# EAGLE design Transmitter_board (EAGLE 8.6.3)
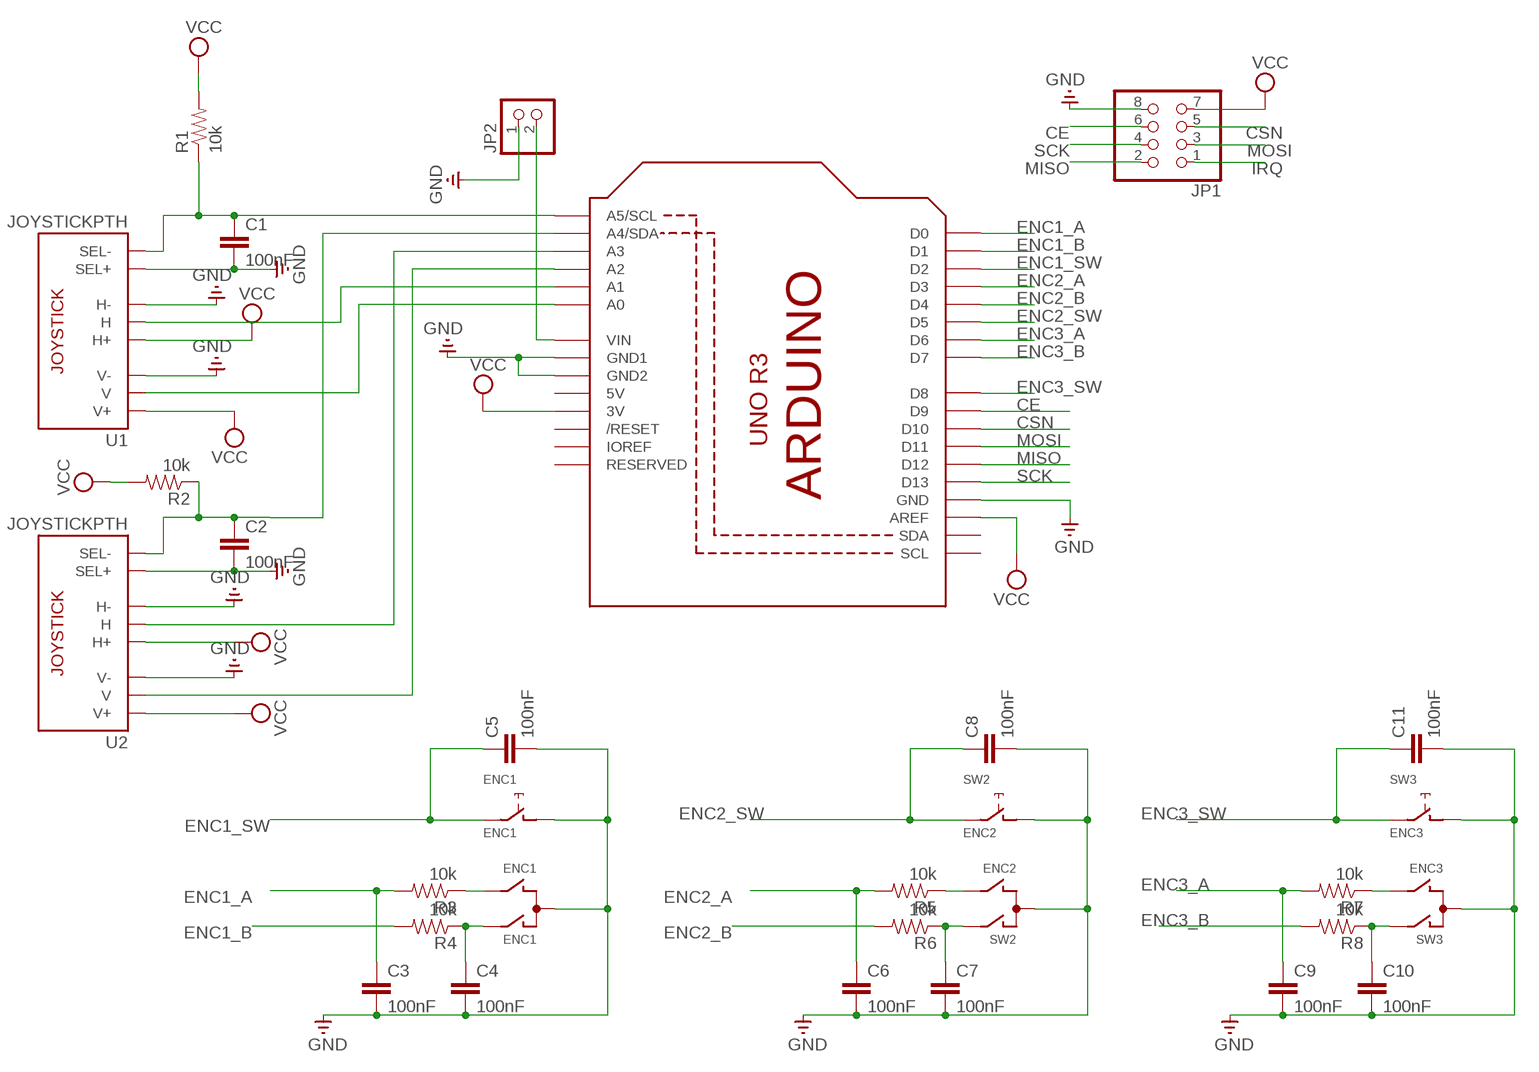
[diagram p0: schematic, sheet 1]

## Parts
C1  100nF  CAP0603-CAP  [0603-CAP]
C2  100nF  CAP0603-CAP  [0603-CAP]
C3  100nF  CAP0603-CAP  [0603-CAP]
C4  100nF  CAP0603-CAP  [0603-CAP]
C5  100nF  CAP0603-CAP  [0603-CAP]
C6  100nF  CAP0603-CAP  [0603-CAP]
C7  100nF  CAP0603-CAP  [0603-CAP]
C8  100nF  CAP0603-CAP  [0603-CAP]
C9  100nF  CAP0603-CAP  [0603-CAP]
C10  100nF  CAP0603-CAP  [0603-CAP]
C11  100nF  CAP0603-CAP  [0603-CAP]
ENC1  ENC1  EC12E_SW  [ALPS_EC12E_SW]
JP1  PINHD-2X4  [2X04]
JP2  PINHD-1X2  [1X02]
R1  10k  RESISTOR0603-RES  [0603-RES]
R2  10k  RESISTOR0603-RES  [0603-RES]
R3  10k  RESISTOR0603-RES  [0603-RES]
R4  10k  RESISTOR0603-RES  [0603-RES]
R5  10k  RESISTOR0603-RES  [0603-RES]
R6  10k  RESISTOR0603-RES  [0603-RES]
R7  10k  RESISTOR0603-RES  [0603-RES]
R8  10k  RESISTOR0603-RES  [0603-RES]
SW2  ENC2  EC12E_SW  [ALPS_EC12E_SW]
SW3  ENC3  EC12E_SW  [ALPS_EC12E_SW]
U1  JOYSTICKPTH  [JOYSTICK]
U2  JOYSTICKPTH  [JOYSTICK]
U3  STM32F746NG  ARDUINOR3-BPLACE  [ARDUINOR3-BPLACE]

## Nets
CE: JP1.6 U3.D9
CSN: JP1.5 U3.D10
ENC1_A: C3.1 R3.2 U3.D0
ENC1_B: R4.2 U3.D1
ENC1_SW: C5.1 ENC1.E U3.D2
ENC2_A: C6.1 R5.2 U3.D3
ENC2_B: R6.2 U3.D4
ENC2_SW: C8.1 SW2.E U3.D5
ENC3_A: C9.1 R7.2 U3.D6
ENC3_B: R8.2 U3.D7
ENC3_SW: C11.1 SW3.E U3.D8
GND: C1.2 C2.2 C3.2 C4.2 C5.2 C6.2 C7.2 C8.2 C9.2 C10.2 C11.2 ENC1.C ENC1.D JP1.8 JP2.1 SW2.C SW2.D SW3.C SW3.D U1.B1A(SEL+) U1.H3(H-) U1.V3(V-) U2.B1A(SEL+) U2.H3(H-) U2.V3(V-) U3.GND U3.GND1 U3.GND2
IRQ: JP1.1
MISO: JP1.2 U3.D12
MOSI: JP1.3 U3.D11
N$1: U2.V2(V) U3.A2
N$2: C2.1 R2.1 U2.B2A(SEL-) U3.A4(A4/SDA)
N$3: JP2.2 U3.VIN
N$4: C1.1 R1.1 U1.B2A(SEL-) U3.A5(A5/SCL)
N$5: C4.1 ENC1.A R4.1
N$6: C7.1 R6.1 SW2.A
N$7: ENC1.B R3.1
N$8: R5.1 SW2.B
N$9: C10.1 R8.1 SW3.A
N$10: R7.1 SW3.B
N$11: U1.H2(H) U3.A1
N$12: U1.V2(V) U3.A0
N$13: U2.H2(H) U3.A3
SCK: JP1.4 U3.D13
VCC: JP1.7 R1.2 R2.2 U1.H1(H+) U1.V1(V+) U2.H1(H+) U2.V1(V+) U3.3V U3.AREF
Unconnected: ENC1.GND1(G) ENC1.GND2(G) SW2.GND1(G) SW2.GND2(G) SW3.GND1(G) SW3.GND2(G) U3.IOREF U3.RESERVED U3.RESET(/RESET) U3.SCL U3.SDA

## Power pins joined to a net without a drawn wire
5V: U3.5V

## Library data of the parts
C1-C11 = PatternAgents-ProtoPads:CAP: Capacitor Standard 0603 ceramic capacitor, and 0.1" leaded capacitor.
ENC1 SW2 SW3 = switch-alps:EC12E_SW: ALPS rotary Encoder EC12E series with switch; MPN: EC12E2424407; OC_FARNELL: 1520813; OC_NEWARK: 74M1068
JP1 = adafruit:PINHD-2X4: PIN HEADER
JP2 = pinhead:PINHD-1X2: PIN HEADER
R1-R8 = PatternAgents-ProtoPads:RESISTOR: Resistor Basic schematic elements and footprints for 0603, 1206, and PTH resistors.
U1 U2 = adafruit:JOYSTICK: Thumb Joystick Joystick commonly found in PS2 controllers. Two pots and a select switch. Adapted from Sparkfun Library (but for more common 6mm switch sticks)
U3 = adafruit:ARDUINOR3: This is a new object for the new Arduino R3 - with extra pins that you may want to use (such as IOref, and duplicated A4/A5

## Board
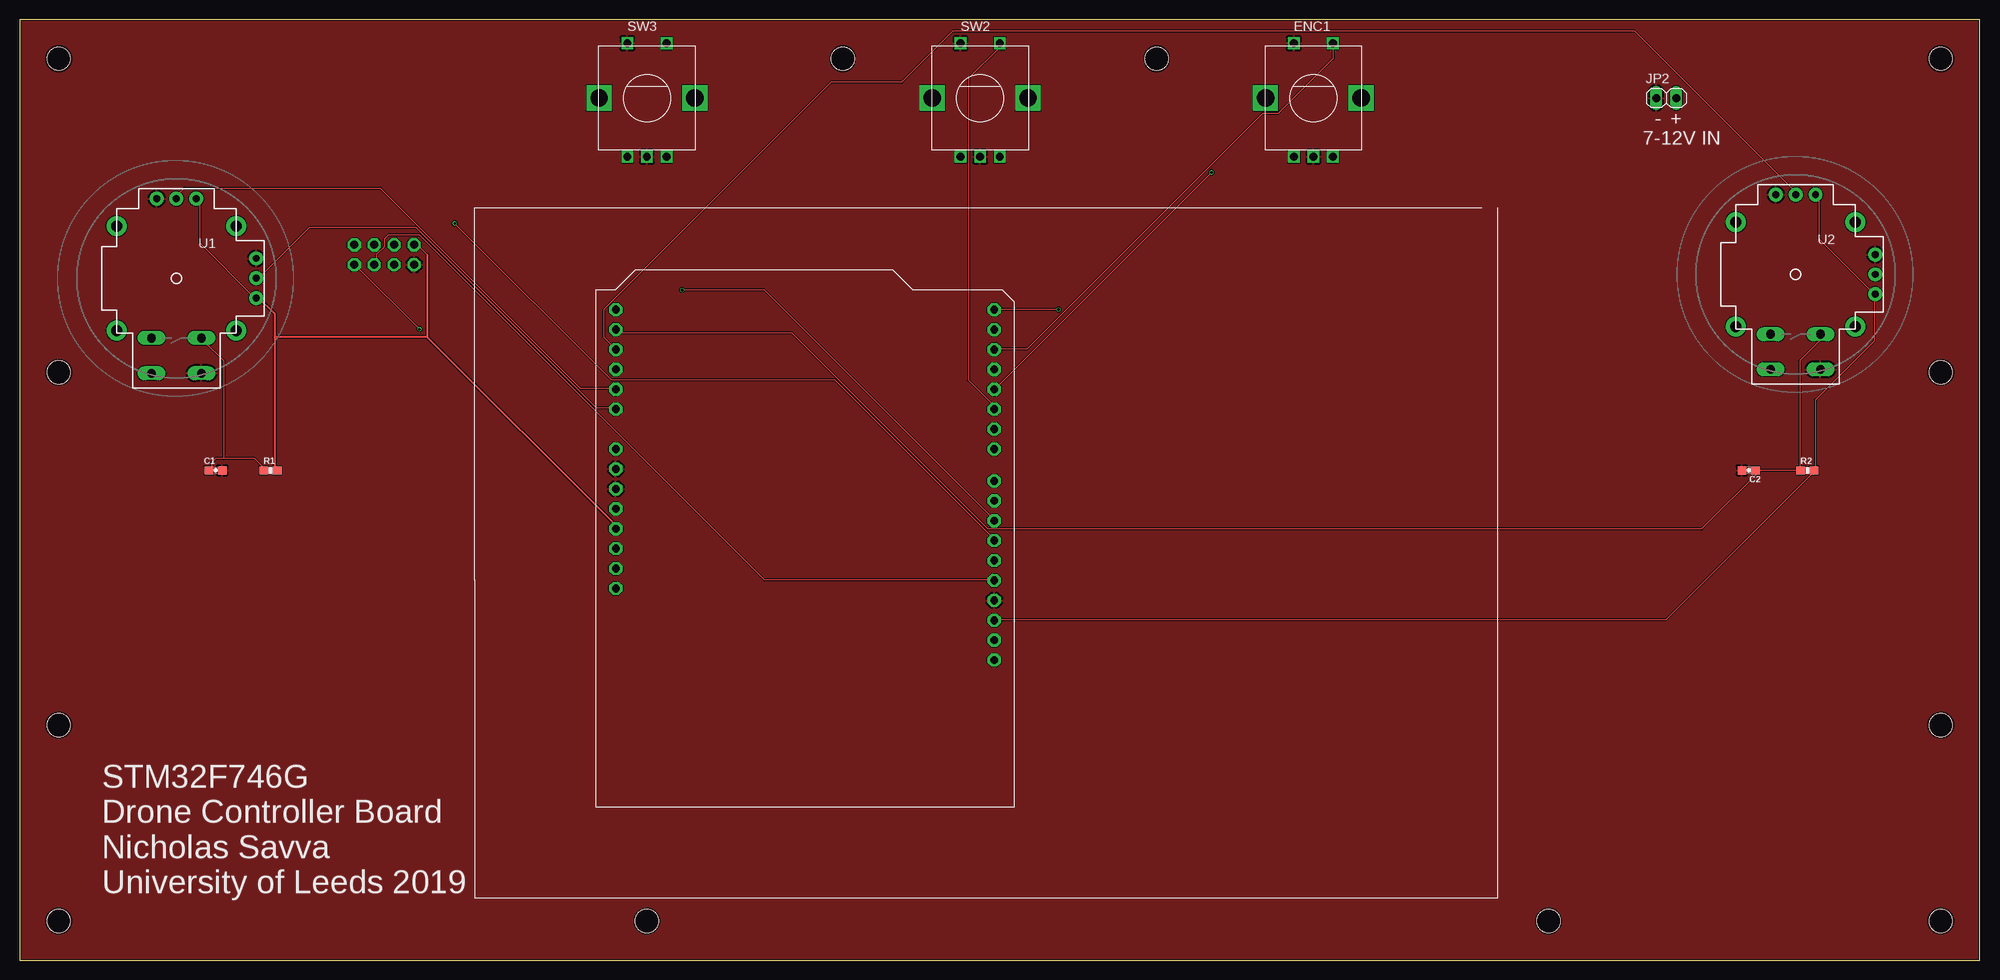
[diagram p1: board, top side]
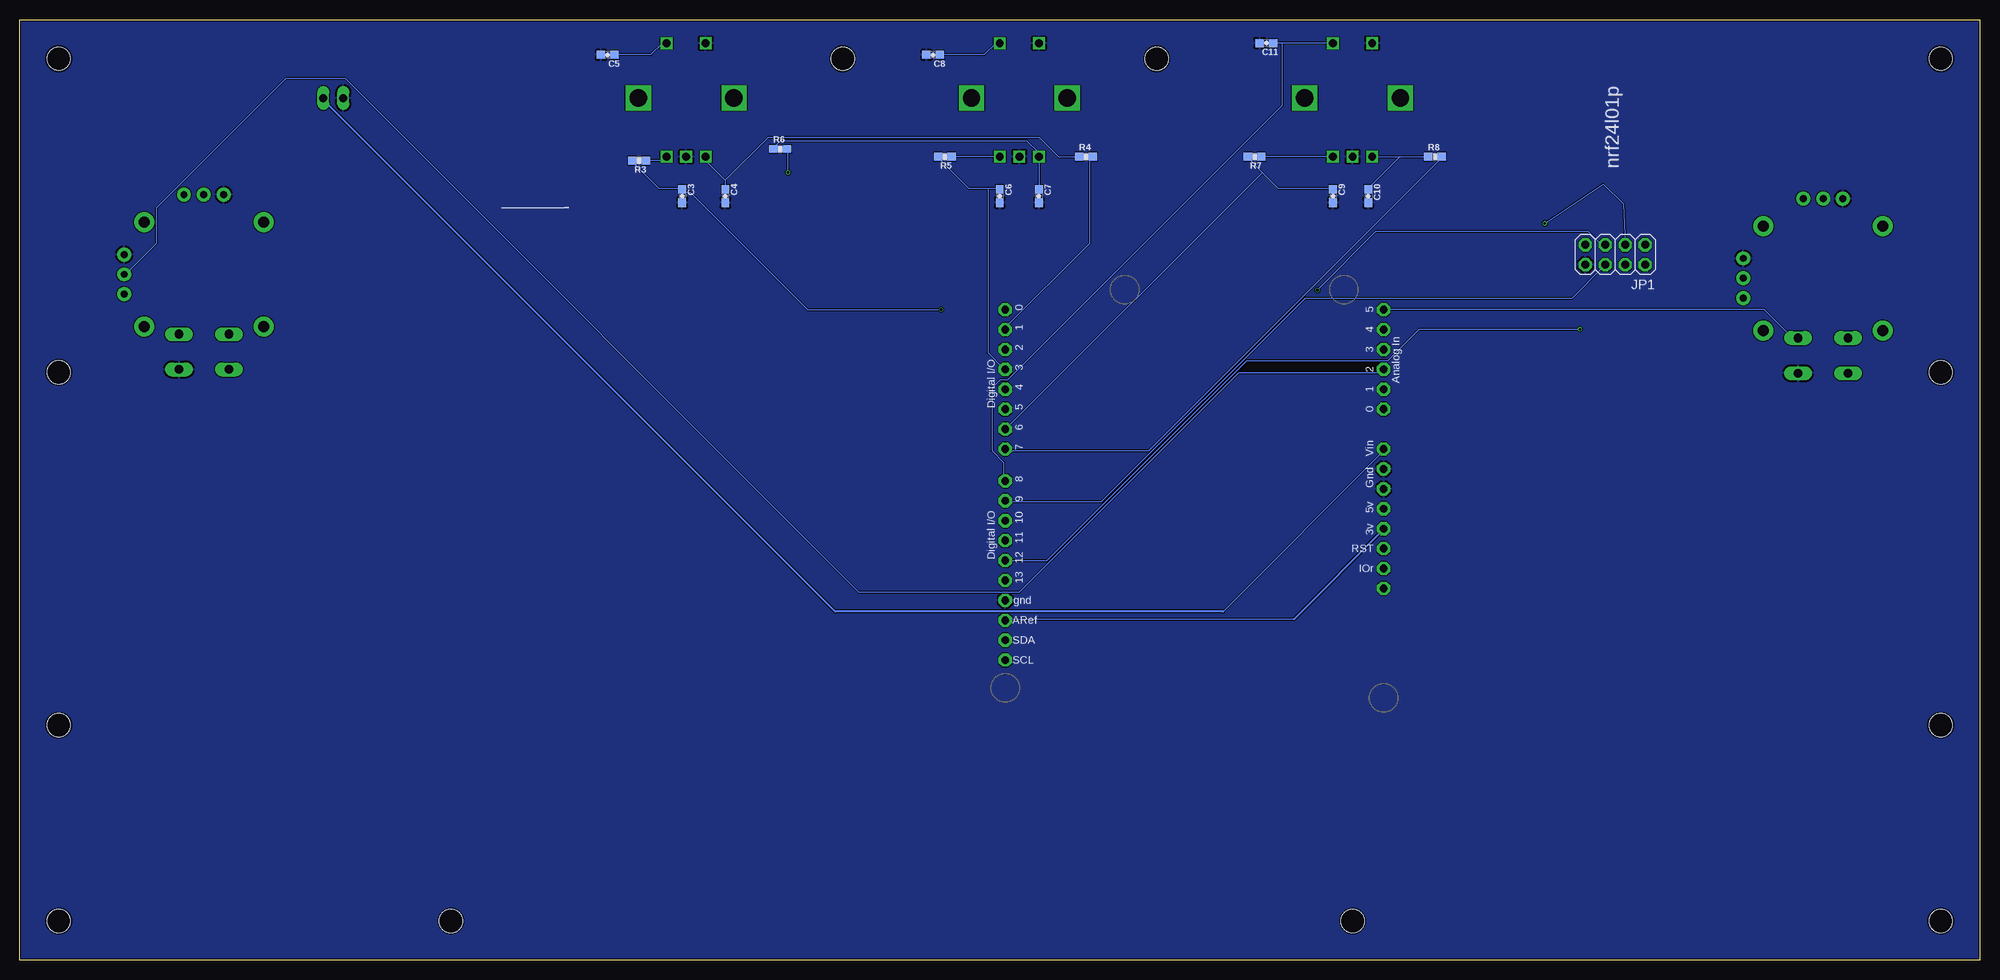
[diagram p2: board, bottom side, seen from below]

Size 250 x 120 mm. Coordinates in mm from the lower left corner, seen from the top.
Outline: 0,0 250,0 250,120 0,120 0,0
Copper layers (1*16): Top 0.035559375mm / dielectric 1.6mm / Bottom 0.035559375mm
Design rules "jlcpcb2layer": minimum track width 5mil, minimum drill 12mil, track to track 5mil, track to pad 5mil, pad to pad 5mil, via to via 5mil, smd to smd 5mil, copper to edge 8mil, drill to drill 6mil, minimum pad ring 5mil, minimum via ring 3mil, stop-mask expansion 2.5mil, vias tented up to drill 0mil, thermal gap 10mil
Holes 3 mm at 245,5 5,5 5,115 245,115 105,115 80,5 5,30 245,75 245,30 5,75 195,5 145,115

### Footprints (pad centres in the part's own frame; a part is rotated, then mirrored left to right if it is on the bottom)
0603-CAP = smd 1.1 x 1: 1 -0.85,0; 2 0.85,0
ALPS_EC12E_SW = drill 1 square: A -2.5,-7.5; B 2.5,-7.5; C 0,-7.5; D -2.5,7; E 2.5,7 | drill 2.2 square: GND1 -6.1,0; GND2 6.1,0
2X04 = drill 1.016 pad 1.676 octagon: 1 -3.81,-1.27; 2 -3.81,1.27; 3 -1.27,-1.27; 4 -1.27,1.27; 5 1.27,-1.27; 6 1.27,1.27; 7 3.81,-1.27; 8 3.81,1.27
1X02 = drill 1.016 long: 1 -1.27,0; 2 1.27,0
0603-RES = smd 1.1 x 1: 1 -0.85,0; 2 0.85,0
JOYSTICK = drill 1.1 pad 1.778 long: B1A -3.175,12.12; B1B 3.175,12.12; B2A -3.175,7.62; B2B 3.175,7.62 | drill 0.889 pad 1.778: H1 -2.54,-10.16; H2 0,-10.16; H3 2.54,-10.16; V1 -10.16,2.54; V2 -10.16,0; V3 -10.16,-2.54 | drill 1.397 pad 2.54: MOUNT1 -7.62,6.668; MOUNT2 -7.62,-6.668; MOUNT3 7.62,-6.668; MOUNT4 7.62,6.668
ARDUINOR3-BPLACE = drill 1 pad 1.676 octagon: 3V 35.56,2.54; 5V 38.1,2.54; A0 50.8,2.54; A1 53.34,2.54; A2 55.88,2.54; A3 58.42,2.54; A4 60.96,2.54; A5 63.5,2.54; AREF 23.876,50.8; D0 63.5,50.8; D1 60.96,50.8; D2 58.42,50.8; D3 55.88,50.8; D4 53.34,50.8; D5 50.8,50.8; D6 48.26,50.8; D7 45.72,50.8; D8 41.656,50.8; D9 39.116,50.8; D10 36.576,50.8; D11 34.036,50.8; D12 31.496,50.8; D13 28.956,50.8; GND 26.416,50.8; GND1 43.18,2.54; GND2 40.64,2.54; IOREF 30.48,2.54; RESERVED 27.94,2.54; RESET 33.02,2.54; SCL 18.796,50.8; SDA 21.336,50.8; VIN 45.72,2.54

### Placement (x,y rotation side)
C1  25,62.5 0 top
C2  220.5,62.5 180 top
C3  165.5,97.5 270 bottom
C4  160,97.5 270 bottom
C5  175,115.5 180 bottom
C6  125,97.5 270 bottom
C7  120,97.5 270 bottom
C8  133.5,115.5 180 bottom
C9  82.5,97.5 270 bottom
C10  78,97.5 270 bottom
C11  91,117 180 bottom
ENC1  165,110 0 top
JP1  46.5,90 180 bottom
JP2  210,110 0 top
R1  32,62.5 0 top
R2  228,62.5 0 top
R3  171,102 180 bottom
R4  114,102.5 0 bottom
R5  132,102.5 180 bottom
R6  153,103.5 0 bottom
R7  92.5,102.5 180 bottom
R8  69.5,102.5 0 bottom
SW2  122.5,110 0 top
SW3  80,110 0 top
U1  20,87 180 top
U2  226.5,87.5 180 top
U3  73.5,19.5 90 bottom

### Tracks (layer width: path | path; a pad name or v marks a point on that pad's centre or on a via)
CE
  Bottom 0.152: JP1.6 48,88.5 52,84.5 86,84.5 112,58.5 124,58.5 U3.D9
CSN  (via drill 0.35)
  Top 0.152: v84.5,85.5 95,85.5 124,56.5 U3.D10
  Bottom 0.152: v84.5,85.5 77,93 50,93 48.5,91.5 48,91.5 JP1.5
ENC1_A  (via drill 0.35)
  Top 0.152: v132.5,83 124.5,83 U3.D0
  Bottom 0.152: R3.2 172,102 168.5,98.5 165.5,98.5 C3.1 165.5,98 164.5,98 149.5,83 v132.5,83
ENC1_B
  Bottom 0.152: R4.2 113.5,102.5 113.5,91.5 124.5,80.5 U3.D1
ENC1_SW
  Top 0.152: ENC1.E 167.5,115 160.5,108 158.5,108 128.5,78 124.5,78 U3.D2
  Bottom 0.152: ENC1.E 168,117 169.5,115.5 174,115.5 C5.1
ENC2_A
  Bottom 0.152: 126.5,98.5 129,98.5 133,102.5 R5.2 | 126.5,98.5 125,98.5 C6.1 | 126.5,98.5 126.5,77.5 124.5,75.5 U3.D3
ENC2_B  (via drill 0.35)
  Top 0.152: v152,100.5 124.5,73 U3.D4
  Bottom 0.152: v152,100.5 152,103.5 R6.2
ENC2_SW
  Top 0.152: SW2.E 125,116.5 121,112.5 121,74 124,71 124,70.5 U3.D5
  Bottom 0.152: SW2.E 125.5,117 127,115.5 132.5,115.5 C8.1
ENC3_A
  Bottom 0.152: 91.5,100.5 93.5,102.5 R7.2 | 91.5,100.5 89.5,98.5 82.5,98.5 C9.1 | 91.5,100.5 124,68 U3.D6
ENC3_B
  Bottom 0.152: R8.2 69,102.5 69,102 106,65 124,65 U3.D7
ENC3_SW
  Bottom 0.152: SW3.E 89,117 | 89,117 90,117 C11.1 | 89,117 89,109 124,74 125,74 126,73 126,65 124.5,63.5 124.5,61.5 U3.D8
GND
  pour Top: 0,0 250,0 250,120 0,120
  pour Bottom: 0,0 250,0 250,120 0,120
MISO  (via drill 0.35)
  Top 0.152: v51,80.5 43,88.5 JP1.2
  Bottom 0.152: v51,80.5 71.5,80.5 75.5,76.5 93.5,76.5 119,51 124,51 U3.D12
MOSI  (via drill 0.35)
  Top 0.152: v55.5,94 75.5,74 104,74 124,54 U3.D11
  Bottom 0.152: v55.5,94 48,99 45.5,96.5 JP1.3
N$1
  Bottom 0.152: U3.A2 76.5,75 94.5,75 122.5,47 143,47 208.5,112.5 216,112.5 232.5,96 232.5,91.5 236.5,87.5 U2.V2
N$2
  Top 0.152: 227,62.5 222,62.5 | 222,62.5 221.5,62.5 C2.1 | 227,62.5 R2.1 227,62.5 | 227,62.5 227,76.5 230,79.5 U2.B2A | 222,62.5 214.5,55 123.5,55 98.5,80 76.5,80 U3.A4
N$3
  Bottom 0.152: 211,109.5 211,110 JP2.2 | 96.5,44.5 76,65 U3.VIN
  Bottom 0.254: 211,109.5 146,44.5 96.5,44.5
N$4
  Top 0.152: 26,64 30,64 31.5,62.5 R1.1 | 26,64 25,64 24.5,63.5 24.5,62.5 C1.1 | 26,64 26,76.5 23.5,79 U1.B2A
  Bottom 0.152: U3.A5 76,83 27.5,83 23.5,79 U1.B2A
N$5
  Bottom 0.152: 160,99.5 160,98.5 C4.1 | 160,99.5 162.5,102 ENC1.A | 160,99.5 154.5,105 120,105 117.5,102.5 115,102.5 R4.1
N$6
  Bottom 0.152: C7.1 120,98.5 SW2.A 120,103 121.5,104.5 153,104.5 153.5,104 153.5,103.5 R6.1
N$7
  Bottom 0.152: ENC1.B 168,102 170,102 R3.1
N$8
  Bottom 0.152: SW2.B 131,102.5 R5.1
N$9
  Bottom 0.152: SW3.A 74,102.5 | 74,102.5 70.5,102.5 R8.1 | 74,102.5 78,98.5 C10.1
N$10
  Bottom 0.152: SW3.B 91.5,102.5 R7.1
N$11
  Top 0.152: U3.A1 76,73 71.5,73 46,98.5 21,98.5 20,97.5 U1.H2
N$12
  Top 0.152: U3.A0 76,70.5 73.5,70.5 50.5,93.5 37,93.5 30.5,87 U1.V2
N$13
  Top 0.152: U3.A3 76,78 74.5,79.5 74.5,83 103.5,112 112.5,112 119,118.5 206,118.5 226.5,98 U2.H2
SCK
  Top 0.152: JP1.4 45.5,89 45.5,90 46.5,91 46.5,92 47,92.5 51,92.5 95,48.5 124,48.5 U3.D13
VCC
  Top 0.152: 32.5,62.5 R1.2 | 30.5,84.5 U1.V1 30,84.5 23,91.5 23,97 U1.H1 | U2.H1 229.5,97.5 229.5,92 236.5,85 U2.V1 236.5,84.5 236.5,79 229,71.5 229,62.5 R2.2 228.5,62.5 228.5,62 210,43.5 124.5,43.5 U3.AREF | 52,90 50.5,91.5 JP1.7 | 76,55.5 U3.3V
  Top 0.254: 32.5,79.5 32.5,82.5 30.5,84.5 | 32.5,79.5 32.5,62.5 | 52,79.5 76,55.5 | 52,90 52,79.5 | 52,79.5 32.5,79.5
  Bottom 0.152: 87.5,43.5 124,43.5 U3.AREF | 76,55 U3.3V
  Bottom 0.254: 76,55 87.5,43.5

### Text on the board
tPlace: - | + | 7-12V IN | STM32F746G / Drone Controller Board / Nicholas Savva / University of Leeds 2019
bPlace: nrf24l01p